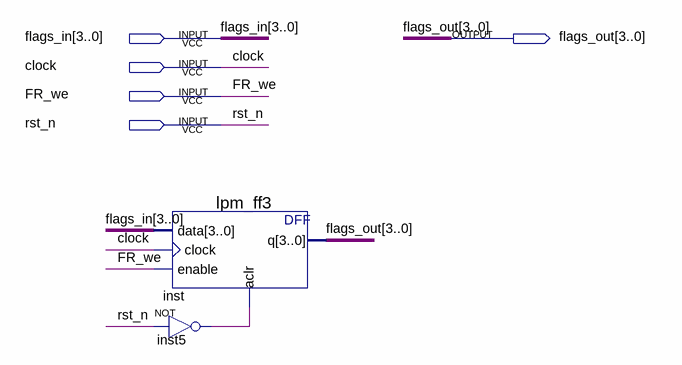
[diagram p0: schematic sheet]
// Quartus schematic fr_unit.bdf as structural Verilog: 2 symbols, 5 pins
module fr_unit (
  input  [3:0] flags_in,
  input  clock,
  input  FR_we,
  input  rst_n,
  output [3:0] flags_out
);

  wire inst5_out;

  lpm_ff3 inst (.data(flags_in), .clock(clock), .enable(FR_we), .aclr(inst5_out), .q(flags_out));
  not inst5 (inst5_out, rst_n);
endmodule
